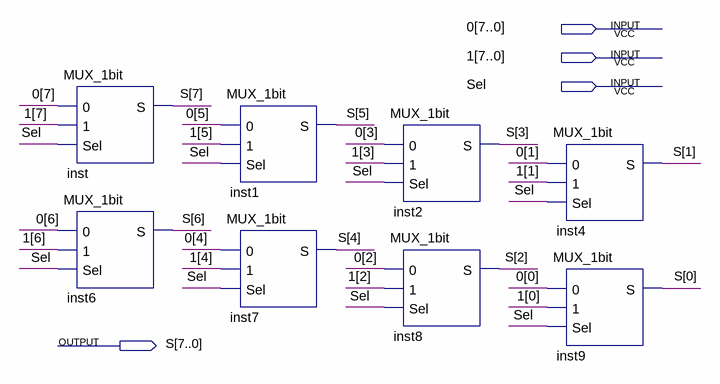
[diagram p0: schematic sheet]
// Quartus schematic MUX_8bit.bdf as structural Verilog: 8 symbols, 4 pins
module MUX_8bit (
  input  [7:0] \0 ,
  input  [7:0] \1 ,
  input  Sel,
  output [7:0] S
);

  MUX_1bit inst (.\0 (\0 [7]), .\1 (\1 [7]), .Sel(Sel), .S(S[7]));
  MUX_1bit inst6 (.\0 (\0 [6]), .\1 (\1 [6]), .Sel(Sel), .S(S[6]));
  MUX_1bit inst1 (.\0 (\0 [5]), .\1 (\1 [5]), .Sel(Sel), .S(S[5]));
  MUX_1bit inst7 (.\0 (\0 [4]), .\1 (\1 [4]), .Sel(Sel), .S(S[4]));
  MUX_1bit inst2 (.\0 (\0 [3]), .\1 (\1 [3]), .Sel(Sel), .S(S[3]));
  MUX_1bit inst8 (.\0 (\0 [2]), .\1 (\1 [2]), .Sel(Sel), .S(S[2]));
  MUX_1bit inst4 (.\0 (\0 [1]), .\1 (\1 [1]), .Sel(Sel), .S(S[1]));
  MUX_1bit inst9 (.\0 (\0 [0]), .\1 (\1 [0]), .Sel(Sel), .S(S[0]));
endmodule
